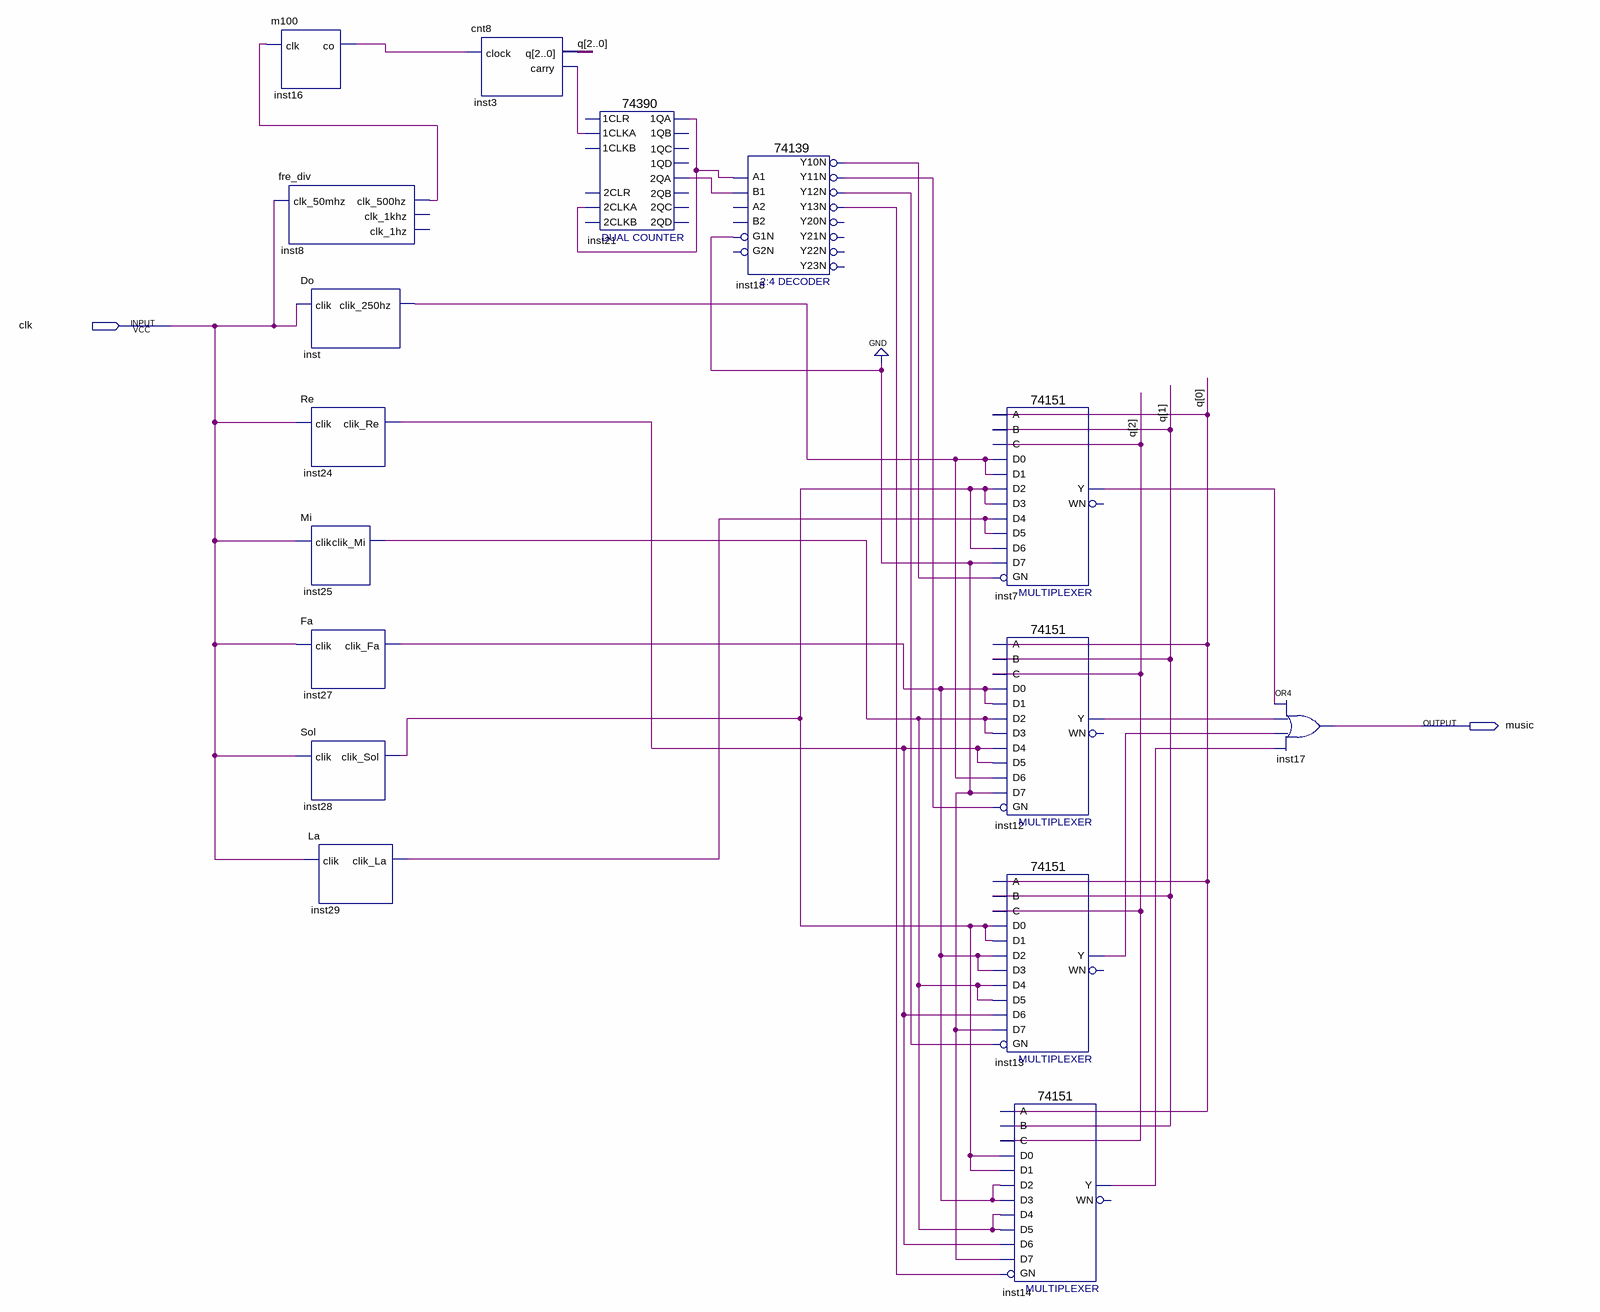
[diagram p0: schematic sheet]
// Quartus schematic music.bdf as structural Verilog: 16 symbols, 2 pins
module music (
  input  clk,
  output music
);

  wire inst3_carry, inst7_y, inst8_clk_500hz, inst12_y, inst13_y, inst14_y, inst16_co, inst18_y10n,
       inst18_y11n, inst18_y12n, inst18_y13n, inst21_1qa, inst21_2qa, inst24_clik_re, inst25_clik_mi,
       inst27_clik_fa, inst28_clik_sol, inst29_clik_la, inst_clik_250hz;
  wire [2:0] q;

  m100 inst16 (.clk(inst8_clk_500hz), .co(inst16_co));
  fre_div inst8 (.clk_50mhz(clk), .clk_500hz(inst8_clk_500hz));  // open: clk_1khz, clk_1hz
  Do inst (.clik(clk), .clik_250hz(inst_clik_250hz));
  Re inst24 (.clik(clk), .clik_Re(inst24_clik_re));
  Mi inst25 (.clik(clk), .clik_Mi(inst25_clik_mi));
  Fa inst27 (.clik(clk), .clik_Fa(inst27_clik_fa));
  Sol inst28 (.clik(clk), .clik_Sol(inst28_clik_sol));
  La inst29 (.clik(clk), .clik_La(inst29_clik_la));
  cnt8 inst3 (.clock(inst16_co), .q(q), .carry(inst3_carry));
  \74390  inst21 (
    .\2CLKA (inst21_1qa), .\1CLKA (inst3_carry), .\1QA (inst21_1qa), .\2QA (inst21_2qa));  // open: 2CLR, 2CLKB, 1CLR, 1CLKB, 1QB, 1QC, 1QD, 2QB, 2QC, 2QD
  \74139  inst18 (
    .A1(inst21_1qa), .B1(inst21_2qa), .G1N(1'b0), .Y10N(inst18_y10n), .Y13N(inst18_y13n), .Y12N(inst18_y12n),
    .Y11N(inst18_y11n));  // open: A2, B2, G2N, Y20N, Y21N, Y22N, Y23N
  \74151  inst7 (
    .GN(inst18_y10n), .C(q[2]), .B(q[1]), .A(q[0]), .D5(inst29_clik_la), .D0(inst_clik_250hz),
    .D1(inst_clik_250hz), .D4(inst29_clik_la), .D3(inst28_clik_sol), .D2(inst28_clik_sol),
    .D6(inst28_clik_sol), .D7(1'b0), .Y(inst7_y));  // open: WN
  \74151  inst12 (
    .GN(inst18_y11n), .C(q[2]), .B(q[1]), .A(q[0]), .D5(inst24_clik_re), .D0(inst27_clik_fa),
    .D1(inst27_clik_fa), .D4(inst24_clik_re), .D3(inst25_clik_mi), .D2(inst25_clik_mi), .D6(inst_clik_250hz),
    .D7(1'b0), .Y(inst12_y));  // open: WN
  \74151  inst13 (
    .GN(inst18_y12n), .C(q[2]), .B(q[1]), .A(q[0]), .D5(inst25_clik_mi), .D0(inst28_clik_sol),
    .D1(inst28_clik_sol), .D4(inst25_clik_mi), .D3(inst27_clik_fa), .D2(inst27_clik_fa), .D6(inst24_clik_re),
    .D7(1'b0), .Y(inst13_y));  // open: WN
  \74151  inst14 (
    .GN(inst18_y13n), .C(q[2]), .B(q[1]), .A(q[0]), .D5(inst25_clik_mi), .D0(inst28_clik_sol),
    .D1(inst28_clik_sol), .D4(inst25_clik_mi), .D3(inst27_clik_fa), .D2(inst27_clik_fa), .D6(inst24_clik_re),
    .D7(1'b0), .Y(inst14_y));  // open: WN
  or inst17 (music, inst7_y, inst12_y, inst13_y, inst14_y);
endmodule
